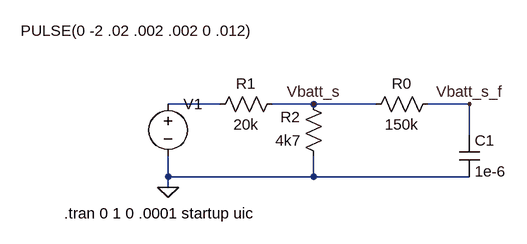
[diagram p0: schematic lpf_Vbatt.asc]
lpf_Vbatt.asc, the LTspice schematic file:
Version 4
SHEET 1 880 680
WIRE 48 96 -32 96
WIRE 192 96 128 96
WIRE 288 96 192 96
WIRE 432 96 368 96
WIRE 432 144 432 96
WIRE -32 208 -32 176
WIRE 192 208 192 176
WIRE 192 208 -32 208
WIRE 432 208 192 208
WIRE -32 224 -32 208
FLAG -32 224 0
FLAG 432 96 Vbatt_s_f
FLAG 192 96 Vbatt_s
SYMBOL cap 416 144 R0
SYMATTR InstName C1
SYMATTR Value 1e-6
SYMBOL voltage -32 80 R0
WINDOW 123 0 0 Left 0
WINDOW 39 0 0 Left 0
WINDOW 3 -227 -97 Left 2
SYMATTR Value PULSE(0 -2 .02 .002 .002 0 .012)
SYMATTR InstName V1
SYMBOL res 144 80 R90
WINDOW 0 0 56 VBottom 2
WINDOW 3 32 56 VTop 2
SYMATTR InstName R1
SYMATTR Value 20k
SYMBOL res 208 192 R180
WINDOW 0 36 76 Left 2
WINDOW 3 36 40 Left 2
SYMATTR InstName R2
SYMATTR Value 4k7
SYMBOL res 384 80 R90
WINDOW 0 0 56 VBottom 2
WINDOW 3 32 56 VTop 2
SYMATTR InstName R0
SYMATTR Value 150k
TEXT -192 264 Left 2 !.tran 0 1 0 .0001 startup uic

The netlist it stands for:
* lpf_Vbatt.asc
C1 Vbatt_s_f 0 1e-6
V1 N001 0 PULSE(0 -2 .02 .002 .002 0 .012)
R1 Vbatt_s N001 20k
R2 0 Vbatt_s 4k7
R0 Vbatt_s_f Vbatt_s 150k
.tran 0 1 0 .0001 startup uic
.backanno
.end